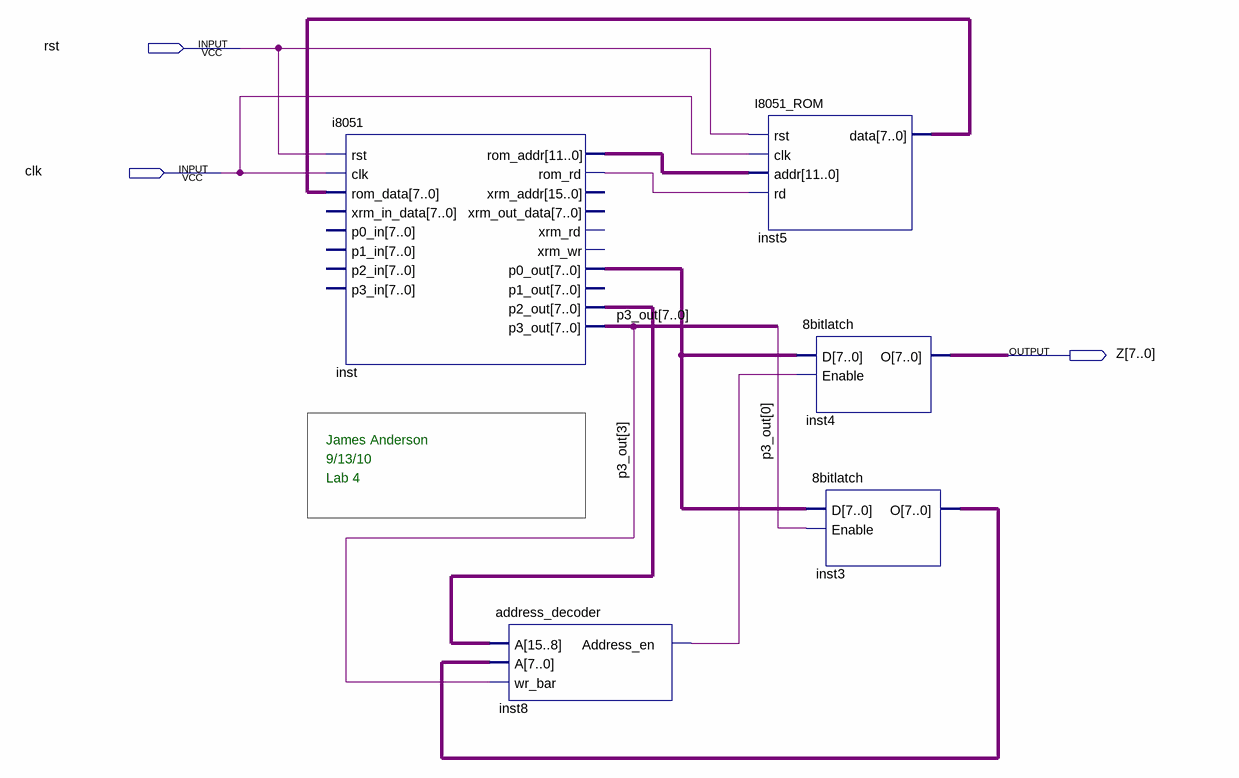
[diagram p0: schematic sheet]
// Quartus schematic Lab4_Top.bdf as structural Verilog: 5 symbols, 3 pins
module Lab4_Top (
  input  rst,
  input  clk,
  output [7:0] Z
);

  wire inst8_address_en, inst_rom_rd;
  wire [7:0] inst3_o, inst5_data, inst_p0_out, inst_p2_out, p3_out;
  wire [11:0] inst_rom_addr;

  i8051 inst (
    .rst(rst), .clk(clk), .rom_data(inst5_data), .rom_addr(inst_rom_addr), .rom_rd(inst_rom_rd),
    .p0_out(inst_p0_out), .p2_out(inst_p2_out), .p3_out(p3_out));  // open: xrm_in_data, p0_in, p1_in, p2_in, p3_in, xrm_addr, xrm_out_data, xrm_rd, xrm_wr, p1_out
  address_decoder inst8 (.A({inst_p2_out, inst3_o}), .wr_bar(p3_out[3]), .Address_en(inst8_address_en));
  I8051_ROM inst5 (.rst(rst), .clk(clk), .addr(inst_rom_addr), .rd(inst_rom_rd), .data(inst5_data));
  \8bitlatch  inst4 (.D(inst_p0_out), .Enable(inst8_address_en), .O(Z));
  \8bitlatch  inst3 (.D(inst_p0_out), .Enable(p3_out[0]), .O(inst3_o));

  // Notes on the sheet:
  //   James Anderson
  //   9/13/10
  //   Lab 4
endmodule
